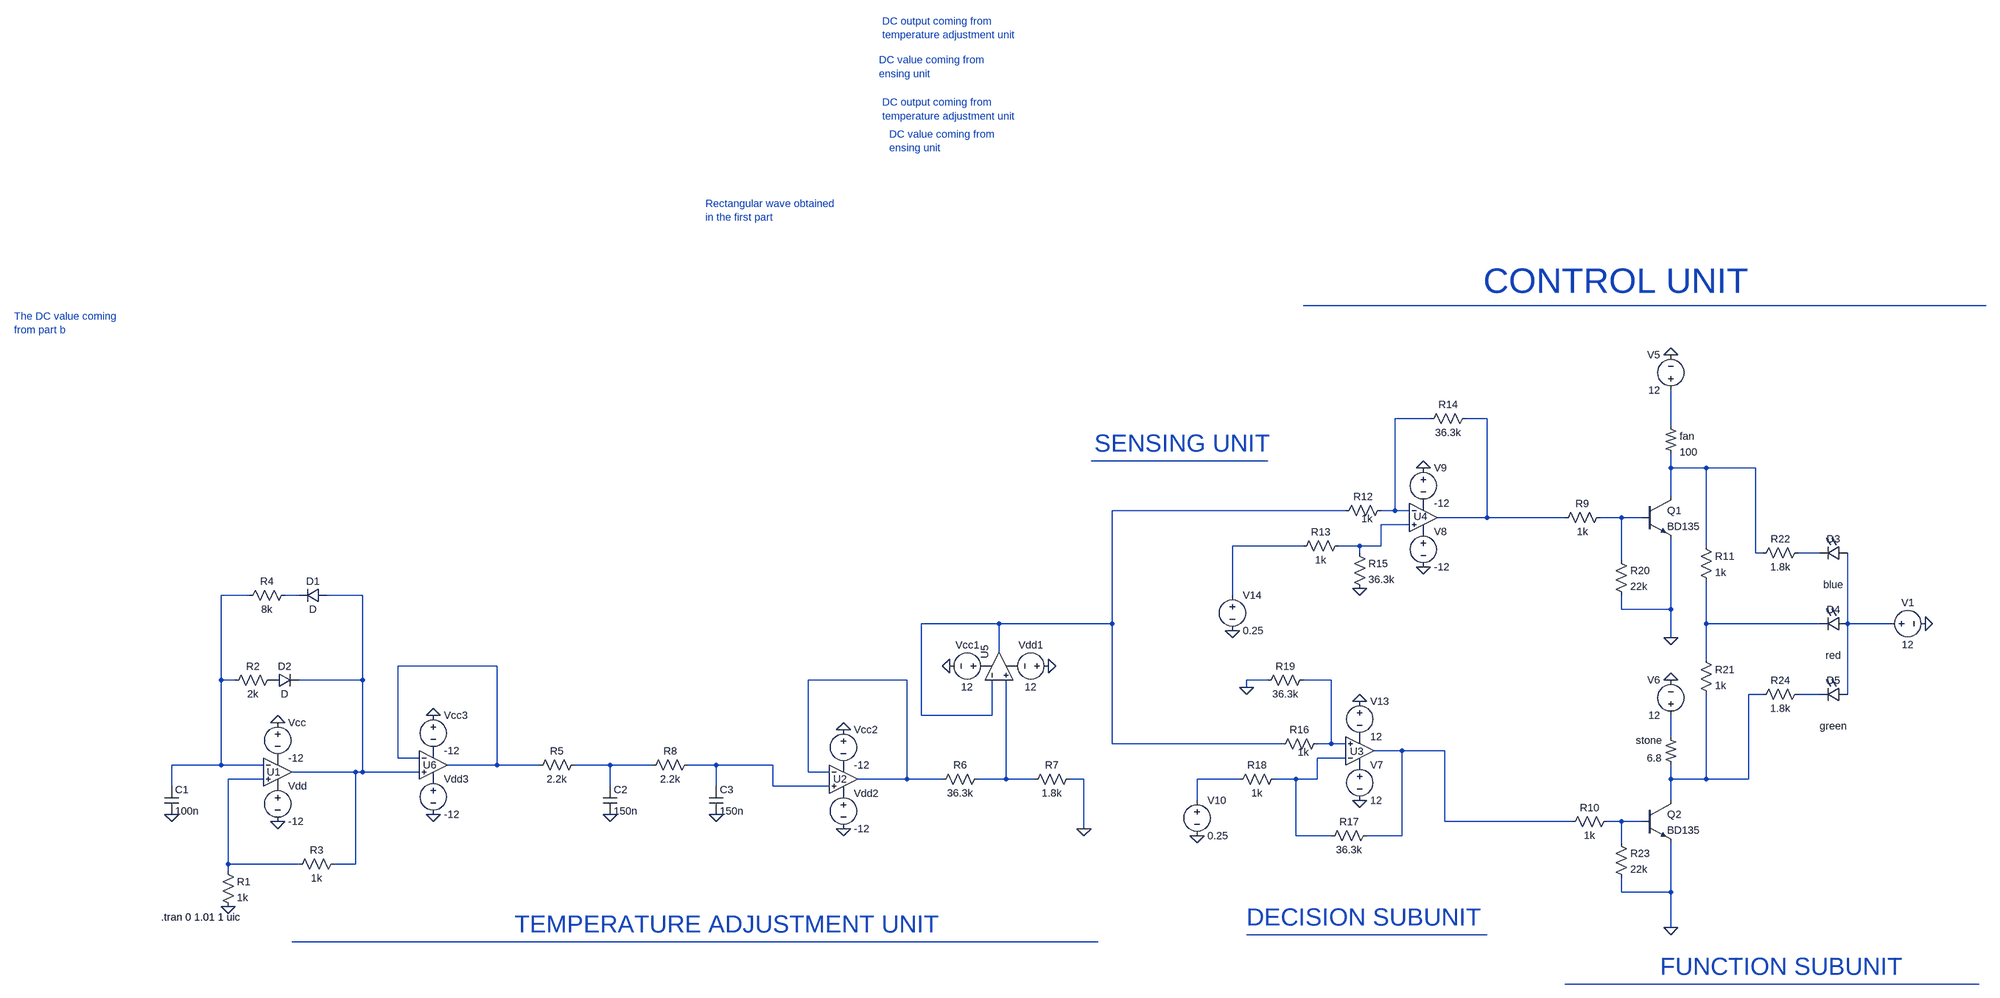
[diagram p0: schematic final projeeend.asc]
final projeeend.asc, the LTspice schematic file:
Version 4
SHEET 1 5204 696
WIRE 3472 -1136 1840 -1136
WIRE 2128 -880 2048 -880
WIRE 2256 -880 2208 -880
WIRE 2672 -864 2672 -944
WIRE 1760 -784 1360 -784
WIRE 2672 -768 2672 -800
WIRE 2752 -768 2672 -768
WIRE 2864 -768 2752 -768
WIRE 2672 -704 2672 -768
WIRE 1936 -672 1408 -672
WIRE 2048 -672 2048 -880
WIRE 2048 -672 2016 -672
WIRE 2080 -672 2048 -672
WIRE 2256 -656 2256 -880
WIRE 2256 -656 2144 -656
WIRE 2432 -656 2256 -656
WIRE 2560 -656 2512 -656
WIRE 2608 -656 2560 -656
WIRE 2080 -640 2016 -640
WIRE 1840 -592 1680 -592
WIRE 1968 -592 1920 -592
WIRE 2016 -592 2016 -640
WIRE 2016 -592 1968 -592
WIRE 2752 -592 2752 -768
WIRE 1968 -576 1968 -592
WIRE 2864 -576 2864 -768
WIRE 2880 -576 2864 -576
WIRE 3008 -576 2960 -576
WIRE 2560 -560 2560 -656
WIRE -544 -480 -608 -480
WIRE -432 -480 -464 -480
WIRE -288 -480 -368 -480
WIRE 1680 -480 1680 -592
WIRE 2560 -448 2560 -480
WIRE 2672 -448 2672 -608
WIRE 2672 -448 2560 -448
WIRE 1152 -416 976 -416
WIRE 1408 -416 1408 -672
WIRE 1408 -416 1152 -416
WIRE 2752 -416 2752 -512
WIRE 3008 -416 2752 -416
WIRE 3072 -416 3072 -576
WIRE 3168 -416 3072 -416
WIRE 2672 -384 2672 -448
WIRE 1152 -352 1152 -416
WIRE 2752 -336 2752 -416
WIRE 16 -320 -208 -320
WIRE -608 -288 -608 -480
WIRE -576 -288 -608 -288
WIRE -288 -288 -288 -480
WIRE -288 -288 -432 -288
WIRE 944 -288 720 -288
WIRE 1760 -288 1712 -288
WIRE 1904 -288 1840 -288
WIRE 1712 -272 1712 -288
WIRE 2880 -256 2848 -256
WIRE 3008 -256 2960 -256
WIRE 3072 -256 3072 -416
WIRE 976 -208 976 -416
WIRE 1136 -208 1136 -288
WIRE 1136 -208 976 -208
WIRE 2672 -160 2672 -208
WIRE 1408 -144 1408 -416
WIRE 1792 -144 1408 -144
WIRE 1904 -144 1904 -288
WIRE 1904 -144 1872 -144
WIRE 1936 -144 1904 -144
WIRE 2064 -128 2000 -128
WIRE 2160 -128 2064 -128
WIRE -208 -112 -208 -320
WIRE -160 -112 -208 -112
WIRE 1936 -112 1872 -112
WIRE -608 -96 -608 -288
WIRE -608 -96 -720 -96
WIRE -512 -96 -608 -96
WIRE 16 -96 16 -320
WIRE 16 -96 -96 -96
WIRE 112 -96 16 -96
WIRE 272 -96 192 -96
WIRE 368 -96 272 -96
WIRE 512 -96 448 -96
WIRE 640 -96 512 -96
WIRE -304 -80 -448 -80
WIRE -288 -80 -288 -288
WIRE -288 -80 -304 -80
WIRE -160 -80 -288 -80
WIRE 720 -80 720 -288
WIRE 768 -80 720 -80
WIRE -512 -64 -592 -64
WIRE 944 -64 944 -288
WIRE 944 -64 832 -64
WIRE 1024 -64 944 -64
WIRE 1168 -64 1168 -288
WIRE 1168 -64 1104 -64
WIRE 1232 -64 1168 -64
WIRE 1344 -64 1312 -64
WIRE 1696 -64 1600 -64
WIRE 1824 -64 1776 -64
WIRE 1872 -64 1872 -112
WIRE 1872 -64 1824 -64
WIRE 2672 -64 2672 -96
WIRE 2752 -64 2752 -256
WIRE 2752 -64 2672 -64
WIRE 2848 -64 2848 -256
WIRE 2848 -64 2752 -64
WIRE -720 -48 -720 -96
WIRE 272 -48 272 -96
WIRE 512 -48 512 -96
WIRE 640 -48 640 -96
WIRE 768 -48 640 -48
WIRE 1600 -16 1600 -64
WIRE 2672 -16 2672 -64
WIRE 2160 32 2160 -128
WIRE 2448 32 2160 32
WIRE 2560 32 2528 32
WIRE 2608 32 2560 32
WIRE 1344 48 1344 -64
WIRE 1824 64 1824 -64
WIRE 1904 64 1824 64
WIRE 2064 64 2064 -128
WIRE 2064 64 1984 64
WIRE 2560 80 2560 32
WIRE -592 128 -592 -64
WIRE -432 128 -592 128
WIRE -304 128 -304 -80
WIRE -304 128 -352 128
WIRE -592 144 -592 128
WIRE 2560 192 2560 160
WIRE 2672 192 2672 80
WIRE 2672 192 2560 192
WIRE 2672 272 2672 192
WIRE 2256 288 1712 288
WIRE 1376 304 -448 304
WIRE 3456 400 2432 400
FLAG -480 -192 0
FLAG -480 32 0
FLAG -592 224 0
FLAG -720 16 0
FLAG 272 16 0
FLAG 800 48 0
FLAG 800 -176 0
FLAG 1344 48 0
FLAG 512 16 0
FLAG 2112 -768 0
FLAG 2112 -544 0
FLAG 1600 64 0
FLAG 1040 -320 0
FLAG 1264 -320 0
FLAG 2672 -1024 0
FLAG 2672 -384 0
FLAG 2672 272 0
FLAG 2672 -288 0
FLAG 1968 -240 0
FLAG 1968 -16 0
FLAG 1680 -400 0
FLAG 1968 -496 0
FLAG 1712 -272 0
FLAG -128 16 0
FLAG -128 -208 0
FLAG 3248 -416 0
SYMBOL Opamps\\UniversalOpamp2 -480 -80 R0
WINDOW 0 -25 0 Left 2
SYMATTR InstName U1
SYMBOL voltage -480 -64 R0
WINDOW 123 0 0 Left 2
WINDOW 39 0 0 Left 2
SYMATTR InstName Vdd
SYMATTR Value -12
SYMBOL voltage -480 -208 R0
WINDOW 123 0 0 Left 2
WINDOW 39 0 0 Left 2
SYMATTR InstName Vcc
SYMATTR Value -12
SYMBOL cap -736 -48 R0
SYMATTR InstName C1
SYMATTR Value 100n
SYMBOL res -608 128 R0
SYMATTR InstName R1
SYMATTR Value 1k
SYMBOL res -480 -304 R90
WINDOW 0 0 56 VBottom 2
WINDOW 3 32 56 VTop 2
SYMATTR InstName R2
SYMATTR Value 2k
SYMBOL res -336 112 R90
WINDOW 0 0 56 VBottom 2
WINDOW 3 32 56 VTop 2
SYMATTR InstName R3
SYMATTR Value 1k
SYMBOL diode -368 -496 R90
WINDOW 0 0 32 VBottom 2
WINDOW 3 32 32 VTop 2
SYMATTR InstName D1
SYMBOL diode -496 -272 R270
WINDOW 0 32 32 VTop 2
WINDOW 3 0 32 VBottom 2
SYMATTR InstName D2
SYMBOL res -448 -496 R90
WINDOW 0 0 56 VBottom 2
WINDOW 3 32 56 VTop 2
SYMATTR InstName R4
SYMATTR Value 8k
SYMBOL res 208 -112 R90
WINDOW 0 0 56 VBottom 2
WINDOW 3 32 56 VTop 2
SYMATTR InstName R5
SYMATTR Value 2.2k
SYMBOL cap 256 -48 R0
SYMATTR InstName C2
SYMATTR Value 150n
SYMBOL Opamps\\UniversalOpamp2 800 -64 R0
WINDOW 0 -23 0 Left 2
SYMATTR InstName U2
SYMBOL voltage 800 -48 R0
WINDOW 123 0 0 Left 2
WINDOW 39 0 0 Left 2
SYMATTR InstName Vdd2
SYMATTR Value -12
SYMBOL voltage 800 -192 R0
WINDOW 123 0 0 Left 2
WINDOW 39 0 0 Left 2
SYMATTR InstName Vcc2
SYMATTR Value -12
SYMBOL res 1120 -80 R90
WINDOW 0 0 56 VBottom 2
WINDOW 3 32 56 VTop 2
SYMATTR InstName R6
SYMATTR Value 36.3k
SYMBOL res 1328 -80 R90
WINDOW 0 0 56 VBottom 2
WINDOW 3 32 56 VTop 2
SYMATTR InstName R7
SYMATTR Value 1.8k
SYMBOL res 464 -112 R90
WINDOW 0 0 56 VBottom 2
WINDOW 3 32 56 VTop 2
SYMATTR InstName R8
SYMATTR Value 2.2k
SYMBOL cap 496 -48 R0
SYMATTR InstName C3
SYMATTR Value 150n
SYMBOL Opamps\\UniversalOpamp2 2112 -656 R0
WINDOW 0 -22 -2 Left 2
SYMATTR InstName U4
SYMBOL res 2032 -688 R90
WINDOW 0 0 56 VBottom 2
WINDOW 3 19 47 VTop 2
SYMATTR InstName R12
SYMATTR Value 1k
SYMBOL voltage 2112 -640 R0
WINDOW 123 0 0 Left 2
WINDOW 39 0 0 Left 2
SYMATTR InstName V8
SYMATTR Value -12
SYMBOL voltage 2112 -784 R0
WINDOW 123 0 0 Left 2
WINDOW 39 0 0 Left 2
SYMATTR InstName V9
SYMATTR Value -12
SYMBOL res 2224 -896 R90
WINDOW 0 0 56 VBottom 2
WINDOW 3 32 56 VTop 2
SYMATTR InstName R14
SYMATTR Value 36.3k
SYMBOL res 1936 -608 R90
WINDOW 0 0 56 VBottom 2
WINDOW 3 32 56 VTop 2
SYMATTR InstName R13
SYMATTR Value 1k
SYMBOL voltage 1600 -32 R0
WINDOW 123 0 0 Left 2
WINDOW 39 0 0 Left 2
SYMATTR InstName V10
SYMATTR Value 0.25
SYMBOL npn 2608 -704 R0
SYMATTR InstName Q1
SYMATTR Value BD135
SYMBOL npn 2608 -16 R0
SYMATTR InstName Q2
SYMATTR Value BD135
SYMBOL Opamps\\UniversalOpamp2 1152 -320 R270
SYMATTR InstName U5
SYMBOL voltage 1136 -320 R90
WINDOW 0 -32 56 VBottom 2
WINDOW 3 32 56 VTop 2
WINDOW 123 0 0 Left 2
WINDOW 39 0 0 Left 2
SYMATTR InstName Vcc1
SYMATTR Value 12
SYMBOL voltage 1280 -320 R90
WINDOW 0 -32 56 VBottom 2
WINDOW 3 32 56 VTop 2
WINDOW 123 0 0 Left 2
WINDOW 39 0 0 Left 2
SYMATTR InstName Vdd1
SYMATTR Value 12
SYMBOL res 1952 -592 R0
SYMATTR InstName R15
SYMATTR Value 36.3k
SYMBOL res 2528 -672 R90
WINDOW 0 0 56 VBottom 2
WINDOW 3 32 56 VTop 2
SYMATTR InstName R9
SYMATTR Value 1k
SYMBOL res 2432 48 R270
WINDOW 0 32 56 VTop 2
WINDOW 3 0 56 VBottom 2
SYMATTR InstName R10
SYMATTR Value 1k
SYMBOL voltage 2672 -928 R180
WINDOW 0 24 96 Left 2
WINDOW 3 24 16 Left 2
WINDOW 123 0 0 Left 2
WINDOW 39 0 0 Left 2
SYMATTR InstName V5
SYMATTR Value 12
SYMBOL res2 2688 -96 R180
WINDOW 0 36 56 Left 2
WINDOW 3 36 16 Left 2
SYMATTR InstName stone
SYMATTR Value 6.8
SYMBOL voltage 2672 -192 R180
WINDOW 0 24 96 Left 2
WINDOW 3 24 16 Left 2
WINDOW 123 0 0 Left 2
WINDOW 39 0 0 Left 2
SYMATTR InstName V6
SYMATTR Value 12
SYMBOL Opamps\\UniversalOpamp2 1968 -128 M180
WINDOW 0 -22 -1 Left 2
SYMATTR InstName U3
SYMBOL res 1888 -160 R90
WINDOW 0 0 56 VBottom 2
WINDOW 3 19 47 VTop 2
SYMATTR InstName R16
SYMATTR Value 1k
SYMBOL voltage 1968 -112 R0
WINDOW 123 0 0 Left 2
WINDOW 39 0 0 Left 2
SYMATTR InstName V7
SYMATTR Value 12
SYMBOL voltage 1968 -256 R0
WINDOW 123 0 0 Left 2
WINDOW 39 0 0 Left 2
SYMATTR InstName V13
SYMATTR Value 12
SYMBOL res 1792 -80 R90
WINDOW 0 0 56 VBottom 2
WINDOW 3 32 56 VTop 2
SYMATTR InstName R18
SYMATTR Value 1k
SYMBOL voltage 1680 -496 R0
WINDOW 123 0 0 Left 2
WINDOW 39 0 0 Left 2
SYMATTR InstName V14
SYMATTR Value 0.25
SYMBOL res2 2656 -864 R0
SYMATTR InstName fan
SYMATTR Value 100
SYMBOL LED 3072 -592 R90
WINDOW 0 0 32 VBottom 2
WINDOW 3 72 32 VTop 2
SYMATTR InstName D3
SYMATTR Value blue
SYMBOL LED 3072 -432 R90
WINDOW 0 0 32 VBottom 2
WINDOW 3 72 32 VTop 2
SYMATTR InstName D4
SYMATTR Value red
SYMBOL LED 3072 -272 R90
WINDOW 0 0 32 VBottom 2
WINDOW 3 72 32 VTop 2
SYMATTR InstName D5
SYMATTR Value green
SYMBOL res 2000 48 R90
WINDOW 0 0 56 VBottom 2
WINDOW 3 32 56 VTop 2
SYMATTR InstName R17
SYMATTR Value 36.3k
SYMBOL res 1856 -304 R90
WINDOW 0 0 56 VBottom 2
WINDOW 3 32 56 VTop 2
SYMATTR InstName R19
SYMATTR Value 36.3k
SYMBOL Opamps\\UniversalOpamp2 -128 -96 R0
WINDOW 0 -23 0 Left 2
SYMATTR InstName U6
SYMBOL voltage -128 -80 R0
WINDOW 123 0 0 Left 2
WINDOW 39 0 0 Left 2
SYMATTR InstName Vdd3
SYMATTR Value -12
SYMBOL voltage -128 -224 R0
WINDOW 123 0 0 Left 2
WINDOW 39 0 0 Left 2
SYMATTR InstName Vcc3
SYMATTR Value -12
SYMBOL res 2544 -576 R0
SYMATTR InstName R20
SYMATTR Value 22k
SYMBOL res 2544 64 R0
SYMATTR InstName R23
SYMATTR Value 22k
SYMBOL voltage 3152 -416 R270
WINDOW 0 32 56 VTop 2
WINDOW 3 -32 56 VBottom 2
WINDOW 123 0 0 Left 2
WINDOW 39 0 0 Left 2
SYMATTR InstName V1
SYMATTR Value 12
SYMBOL res 2736 -608 R0
SYMATTR InstName R11
SYMATTR Value 1k
SYMBOL res 2736 -352 R0
SYMATTR InstName R21
SYMATTR Value 1k
SYMBOL res 2976 -592 R90
WINDOW 0 0 56 VBottom 2
WINDOW 3 32 56 VTop 2
SYMATTR InstName R22
SYMATTR Value 1.8k
SYMBOL res 2976 -272 R90
WINDOW 0 0 56 VBottom 2
WINDOW 3 32 56 VTop 2
SYMATTR InstName R24
SYMATTR Value 1.8k
TEXT -744 248 Left 2 !.tran 0 1.01 1 uic
TEXT 488 -1912 Left 2 ;Rectangular wave obtained\nin the first part
TEXT -2128 -1112 Left 2 ;The DC value coming\nfrom part b
TEXT 888 -6232 Left 2 ;DC output coming from \ntemperature adjustment unit
TEXT 880 -6144 Left 2 ;DC value coming from\nensing unit
TEXT 888 -6048 Left 2 ;DC output coming from \ntemperature adjustment unit
TEXT 904 -5976 Left 2 ;DC value coming from\nensing unit
TEXT 56 264 Left 5 ;TEMPERATURE ADJUSTMENT UNIT
TEXT 1368 -824 Left 5 ;SENSING UNIT
TEXT 1712 248 Left 5 ;DECISION SUBUNIT
TEXT 2648 360 Left 5 ;FUNCTION SUBUNIT
TEXT 2248 -1192 Left 6 ;CONTROL UNIT

The netlist it stands for:
* final projeeend.asc
XU1 N027 N012 P001 P002 N014 level.2 Avol=1Meg GBW=10Meg Slew=10Meg ilimit=25m rail=0 Vos=0 phimargin=45 en=0 enk=0 in=0 ink=0 Rin=500Meg  ; pins IN+ IN- V+ V- OUT
Vdd P002 0 -12
Vcc 0 P001 -12
C1 N012 0 100n
R1 N027 0 1k
R2 P003 N012 2k
R3 N014 N027 1k
D1 N014 N013 D
D2 P003 N014 D
R4 N013 N012 8k
R5 N025 N017 2.2k
C2 N025 0 150n
XU2 N026 N018 P004 P005 N018 level.2 Avol=1Meg GBW=10Meg Slew=10Meg ilimit=25m rail=0 Vos=0 phimargin=45 en=0 enk=0 in=0 ink=0 Rin=500Meg  ; pins IN+ IN- V+ V- OUT
Vdd2 P005 0 -12
Vcc2 0 P004 -12
R6 N028 N018 36.3k
R7 0 N028 1.8k
R8 N026 N025 2.2k
C3 N026 0 150n
XU4 N009 N002 P006 P007 N003 level.2 Avol=1Meg GBW=10Meg Slew=10Meg ilimit=25m rail=0 Vos=0 phimargin=45 en=0 enk=0 in=0 ink=0 Rin=500Meg  ; pins IN+ IN- V+ V- OUT
R12 N002 N007 1k
V8 P007 0 -12
V9 0 P006 -12
R14 N003 N002 36.3k
R13 N009 N010 1k
V10 N029 0 0.25
Q1 N006 N008 0 0 BD135
Q2 N020 N030 0 0 BD135
XU5 N028 N007 P008 P009 N007 level.2 Avol=1Meg GBW=10Meg Slew=10Meg ilimit=25m rail=0 Vos=0 phimargin=45 en=0 enk=0 in=0 ink=0 Rin=500Meg  ; pins IN+ IN- V+ V- OUT
Vcc1 P008 0 12
Vdd1 0 P009 12
R15 N009 0 36.3k
R9 N008 N003 1k
R10 N023 N030 1k
V5 N004 0 12
R§stone N020 N022 6.8
V6 N022 0 12
XU3 N019 N024 P010 P011 N023 level.2 Avol=1Meg GBW=10Meg Slew=10Meg ilimit=25m rail=0 Vos=0 phimargin=45 en=0 enk=0 in=0 ink=0 Rin=500Meg  ; pins IN+ IN- V+ V- OUT
R16 N019 N007 1k
V7 P010 0 12
V13 0 P011 12
R18 N024 N029 1k
V14 N010 0 0.25
R§fan N004 N006 100
D3 N016 N011 blue
D4 N016 N015 red
D5 N016 N021 green
R17 N023 N024 36.3k
R19 N019 0 36.3k
XU6 N014 N017 P012 P013 N017 level.2 Avol=1Meg GBW=10Meg Slew=10Meg ilimit=25m rail=0 Vos=0 phimargin=45 en=0 enk=0 in=0 ink=0 Rin=500Meg  ; pins IN+ IN- V+ V- OUT
Vdd3 P013 0 -12
Vcc3 0 P012 -12
R20 N008 0 22k
R23 N030 0 22k
V1 N016 0 12
R11 N006 N015 1k
R21 N015 N020 1k
R22 N011 N006 1.8k
R24 N021 N020 1.8k
.model D D
.lib standard.dio
.model NPN NPN
.model PNP PNP
.lib standard.bjt
.tran 0 1.01 1 uic
* Rectangular wave obtained
* in the first part
* The DC value coming
* from part b
* DC output coming from
* temperature adjustment unit
* DC value coming from
* ensing unit
* DC output coming from
* temperature adjustment unit
* DC value coming from
* ensing unit
* TEMPERATURE ADJUSTMENT UNIT
* SENSING UNIT
* DECISION SUBUNIT
* FUNCTION SUBUNIT
* CONTROL UNIT
.lib UniversalOpamps2.sub
.backanno
.end